# EAGLE design va_sense (EAGLE 6.4)
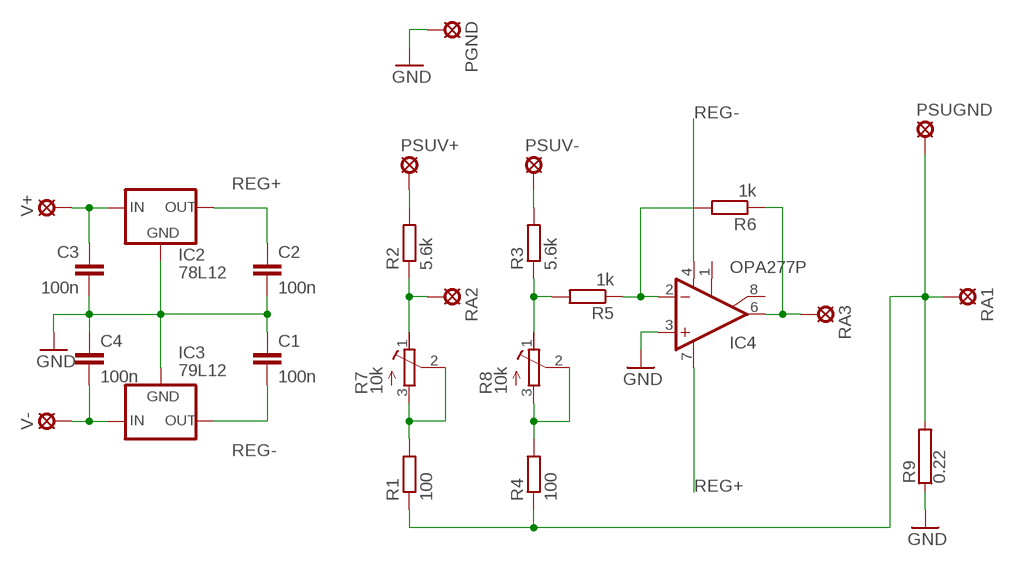
[diagram p0: schematic, sheet 1]

## Parts
C1  100n  C-EUC0805K  [C0805K]
C2  100n  C-EUC0805K  [C0805K]
C3  100n  C-EUC0805K  [C0805K]
C4  100n  C-EUC0805K  [C0805K]
IC2  78L12  78LXX  [78LXX]
IC3  79L12  79LXX  [79LXX]
IC4  OPA277P  [DIL08]
PGND  SE13  [SE13]
PSUGND  SE13  [SE13]
PSUV+  SE13  [SE13]
PSUV-  SE13  [SE13]
R1  100  R-EU_0207/10  [0207/10]
R2  5.6k  R-EU_0207/10  [0207/10]
R3  5.6k  R-EU_0207/10  [0207/10]
R4  100  R-EU_0207/10  [0207/10]
R5  1k  R-EU_0207/10  [0207/10]
R6  1k  R-EU_0207/10  [0207/10]
R7  10k  R-TRIMM3006P  [RTRIM3006P]
R8  10k  R-TRIMM3006P  [RTRIM3006P]
R9  0.22  RKH208-8  [KH208-8]
RA1  SE13  [SE13]
RA2  SE13  [SE13]
RA3  SE13  [SE13]
V+  SE13  [SE13]
V-  SE13  [SE13]

## Nets
GND: C1.1 C2.2 C3.2 C4.1 IC2.GND IC3.GND IC4.3(+IN) PGND.MP R9.1
N$1: R1.2 R7.2(S) R7.3(E)
N$2: R2.1 R7.1(A) RA2.MP
N$3: R3.1 R5.2 R8.1(A)
N$4: R4.2 R8.2(S) R8.3(E)
N$5: IC4.2(-IN) R5.1 R6.2
N$6: IC4.6(OUT) R6.1 RA3.MP
N$7: PSUV+.MP R2.2
N$8: PSUV-.MP R3.2
N$9: PSUGND.MP R1.1 R4.1 R9.2 RA1.MP
N$12: C3.1 IC2.IN V+.MP
N$13: C4.2 IC3.IN V-.MP
REG+: C2.1 IC2.OUT IC4.7(V+)
REG-: C1.2 IC3.OUT IC4.4(V-)
Unconnected: IC4.1(CMP1) IC4.8(CMP2)

## Library data of the parts
C1-C4 = rcl:C-EU: CAPACITOR, European symbol
IC2 = v-reg:78LXX: VOLTAGE REGULATOR
IC3 = v-reg:79LXX: VOLTAGE REGULATOR
IC4 = linear:OPA277: High Precision OPERATIONAL AMPLIFIERS REPLACES OP-07, OP-77, OP-177 Source: opa277.pdf
PGND PSUGND PSUV+ PSUV- RA1-RA3 V+ V- = solpad:SE13: SOLDER PAD E1542, drill 1,3mm, distributor Buerklin, 07F815
R1-R6 = resistor:R-EU_: RESISTOR, European symbol
R7 R8 = resistor:R-TRIMM: Trimm resistor
R9 = resistor-power:R: Power Resitor; OC_FARNELL: unknown; OC_NEWARK: unknown

## Board
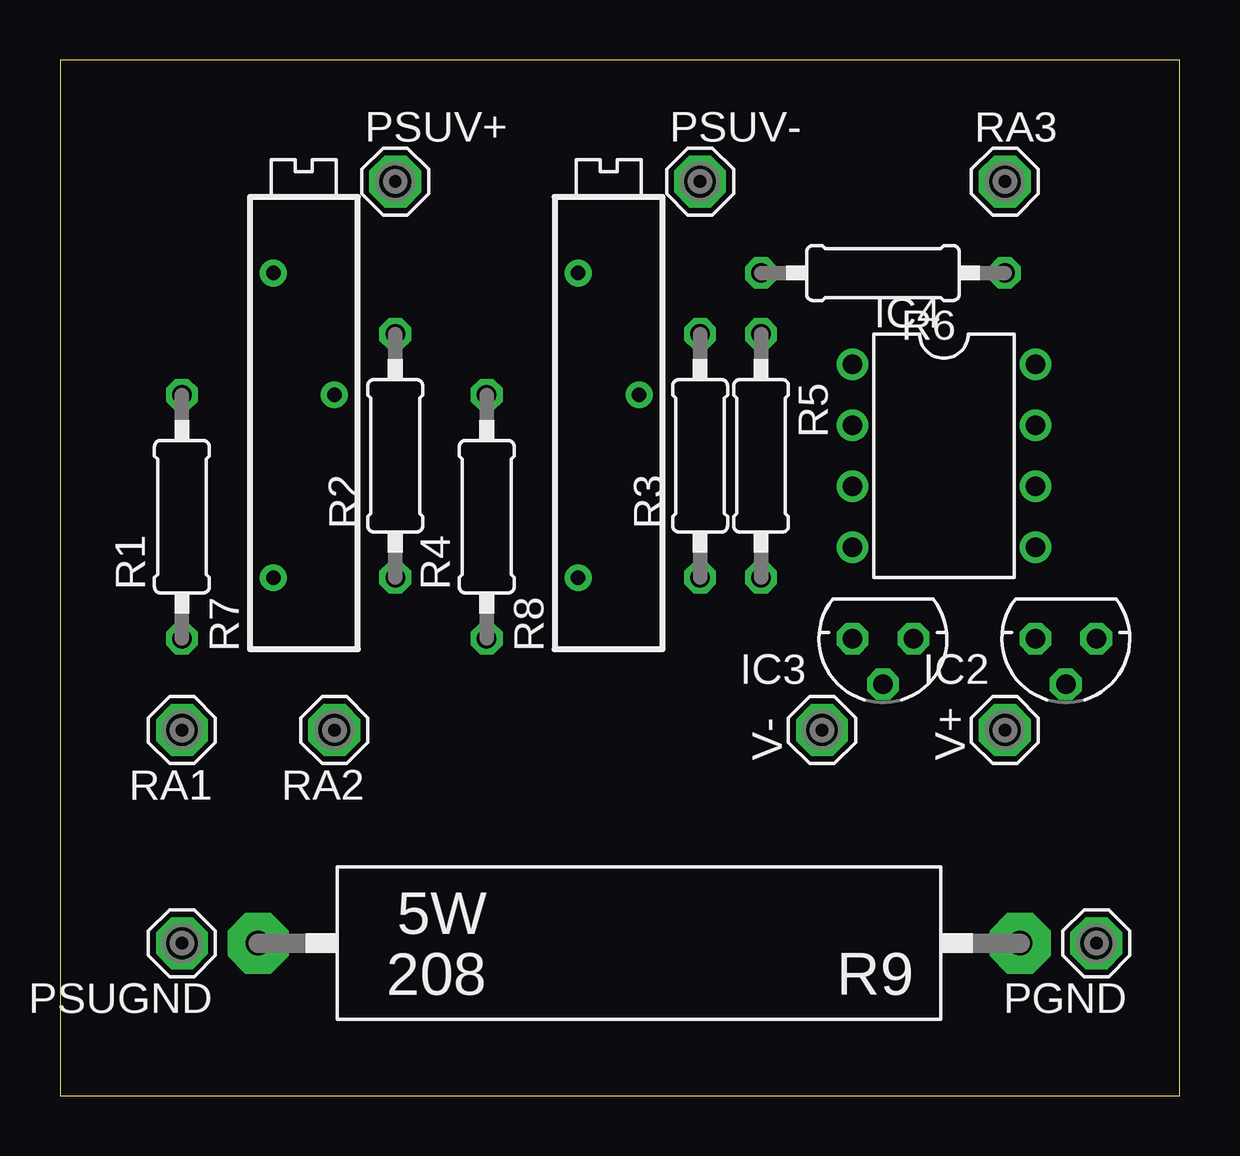
[diagram p1: board, top side]
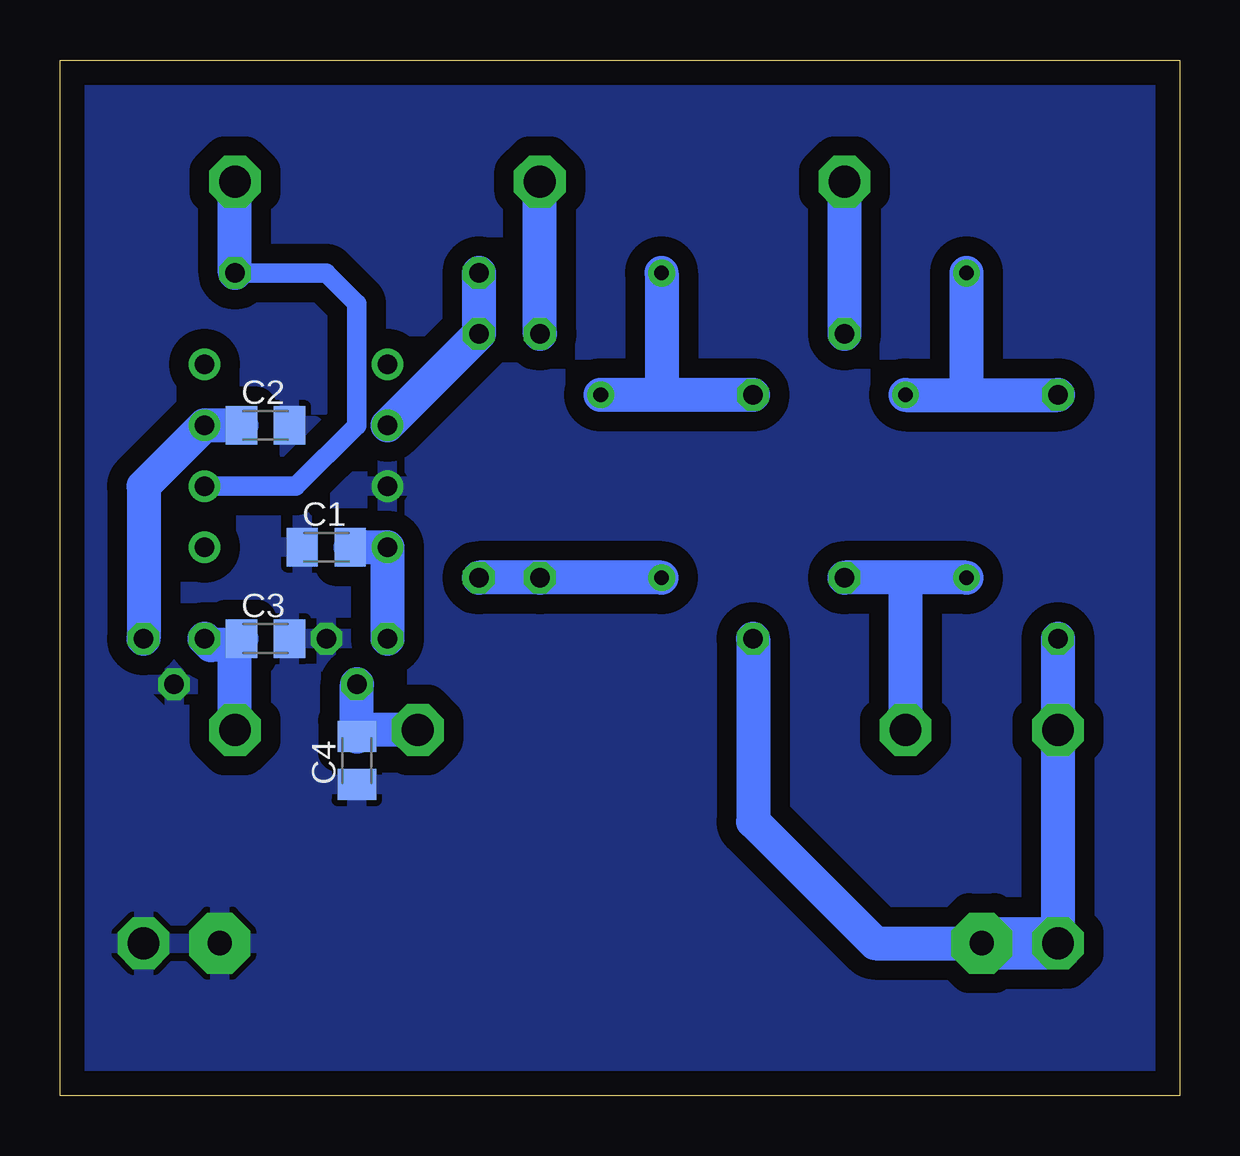
[diagram p2: board, bottom side, seen from below]

Size 46.66 x 43.17 mm. Coordinates in mm from the lower left corner, seen from the top.
Outline: 0,0 46.66,0 46.66,43.17 0,43.17 0,0
Copper layers (1*16): Top 0.035mm / dielectric 1.5mm / Bottom 0.035mm
Design rules "default": minimum track width 10mil, minimum drill 24mil, track to track 8mil, track to pad 8mil, pad to pad 8mil, via to via 8mil, smd to smd 8mil, copper to edge 40mil, drill to drill 8mil, minimum pad ring 10mil, minimum via ring 8mil, stop-mask expansion 4mil, vias tented up to drill 0mil, thermal gap 10mil

### Footprints (pad centres in the part's own frame; a part is rotated, then mirrored left to right if it is on the bottom)
C0805K = smd 1.3 x 1.6: 1 -1,0; 2 1,0
78LXX = drill 0.813 octagon: GND 0,1.905; IN 1.27,0; OUT -1.27,0
79LXX = drill 0.813 octagon: GND -1.27,0; IN 0,1.905; OUT 1.27,0
DIL08 = drill 0.813 pad 1.27: 1 -3.81,-3.81; 2 -1.27,-3.81; 3 1.27,-3.81; 4 3.81,-3.81; 5 3.81,3.81; 6 1.27,3.81; 7 -1.27,3.81; 8 -3.81,3.81
SE13 = drill 1.321 pad 2.159 octagon: MP 0,0
0207/10 = drill 0.813 octagon: 1 -5.08,0; 2 5.08,0
RTRIM3006P = drill 0.61: 1 -7.62,1.27; 2 0,-1.27; 3 5.08,1.27
KH208-8 = drill 1.016 pad 2.54 octagon: 1 -15.875,0; 2 15.875,0

### Placement (x,y rotation side)
C1  35.56,22.86 0 bottom
C2  38.1,27.94 0 bottom
C3  38.1,19.05 0 bottom
C4  34.29,13.97 90 bottom
IC2  41.91,19.05 180 top
IC3  34.29,19.05 180 top
IC4  36.83,26.67 270 top
PGND  43.18,6.35 180 top
PSUGND  5.08,6.35 180 top
PSUV+  13.97,38.1 0 top
PSUV-  26.67,38.1 0 top
R1  5.08,24.13 90 top
R2  13.97,26.67 90 top
R3  26.67,26.67 90 top
R4  17.78,24.13 90 top
R5  29.21,26.67 270 top
R6  34.29,34.29 180 top
R7  10.16,29.21 90 top
R8  22.86,29.21 90 top
R9  24.13,6.35 180 top
RA1  5.08,15.24 180 top
RA2  11.43,15.24 180 top
RA3  39.37,38.1 0 top
V+  39.37,15.24 90 top
V-  31.75,15.24 90 top

### Tracks (layer width: path | path; a pad name or v marks a point on that pad's centre or on a via)
GND
  pour Bottom (isolate 0.813): 0,44.45 0,0 46.99,0 46.99,44.45
N$1
  Bottom 1.422: R7.2 8.89,29.21 | 8.89,29.21 R1.2 | R7.3 8.89,29.21
N$2
  Bottom 1.422: R7.1 11.43,21.59 | 11.43,21.59 R2.1 | RA2.MP 11.43,21.59
N$3
  Bottom 1.422: R8.1 R3.1 R5.2
N$4
  Bottom 1.422: R4.2 21.59,29.21 | 21.59,29.21 R8.2 | R8.3 21.59,29.21
N$5
  Bottom 1.422: R6.2 R5.1 IC4.2
N$6
  Bottom 0.813: IC4.6 36.83,25.4 34.29,27.94 34.29,33.02 35.56,34.29 R6.1
  Bottom 1.422: R6.1 RA3.MP
N$7
  Bottom 1.422: R2.2 PSUV+.MP
N$8
  Bottom 1.422: R3.2 PSUV-.MP
N$9
  Bottom 1.422: R1.1 RA1.MP PSUGND.MP | R4.1 17.78,11.43 12.7,6.35 7.62,6.35
  Bottom 2.184: PSUGND.MP 7.62,6.35 R9.2
N$12
  Bottom 1.422: V+.MP 39.37,18.78 | 39.37,18.78 C3.1 | 39.37,18.78 40.37,18.78 IC2.IN
N$13
  Bottom 1.422: V-.MP 34.02,15.24 C4.2 IC3.IN
REG+
  Bottom 1.422: IC2.OUT 43.18,25.4 IC4.7 C2.1
REG-
  Bottom 1.422: C1.2 IC4.4 IC3.OUT